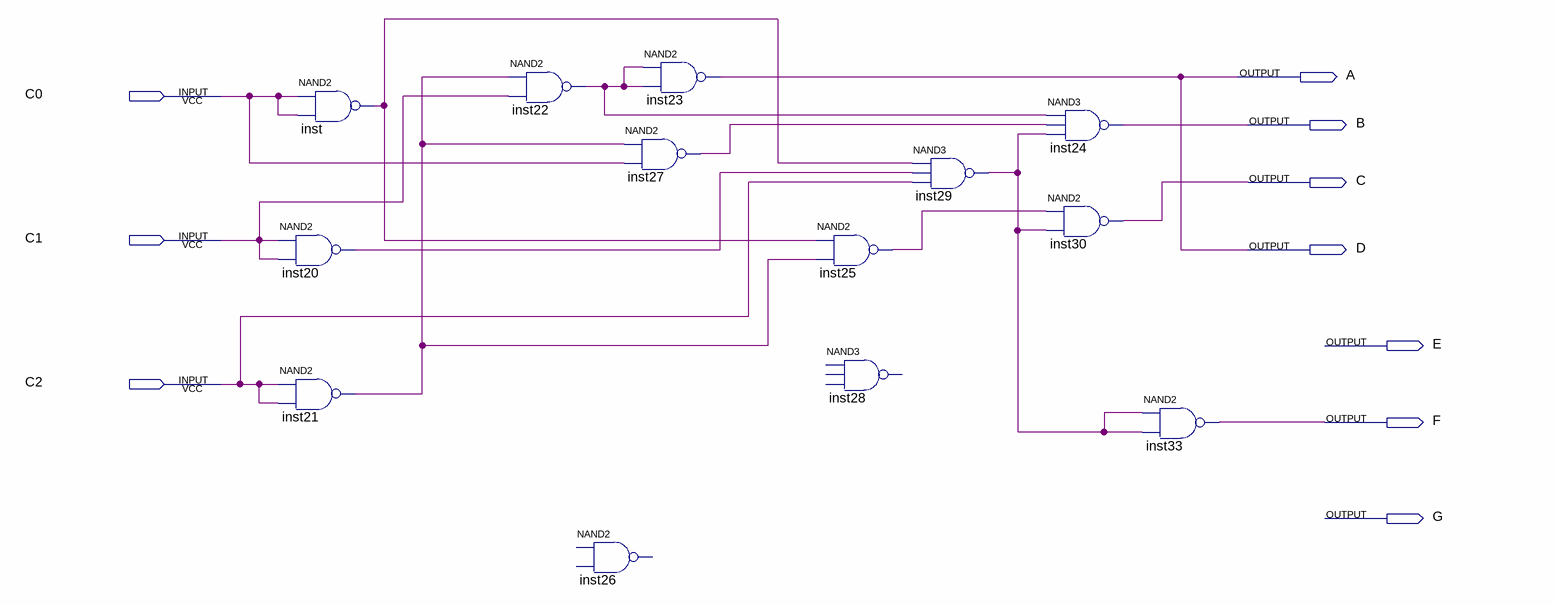
[diagram p0: schematic sheet]
// Quartus schematic coder_nda2_2.bdf as structural Verilog: 13 symbols, 10 pins
module coder_nda2_2 (
  input  C0,
  input  C1,
  input  C2,
  output A,
  output B,
  output C,
  output D,
  output E,
  output F,
  output G
);

  wire inst20_out, inst21_out, inst22_out, inst25_out, inst27_out, inst29_out, inst_out;

  nand inst20 (inst20_out, C1, C1);
  nand inst21 (inst21_out, C2, C2);
  nand inst (inst_out, C0, C0);
  nand inst22 (inst22_out, inst21_out, C1);
  // NAND2 inst26 is placed but not wired
  nand inst23 (A, inst22_out, inst22_out);
  nand inst27 (inst27_out, inst21_out, C0);
  nand inst25 (inst25_out, inst_out, inst21_out);
  // NAND3 inst28 is placed but not wired
  nand inst29 (inst29_out, inst_out, inst20_out, C2);
  nand inst24 (B, inst22_out, inst27_out, inst29_out);
  nand inst30 (C, inst25_out, inst29_out);
  nand inst33 (F, inst29_out, inst29_out);

  assign D = A;
endmodule
